# EAGLE schematic voltage_playground (EAGLE 9.4.2)
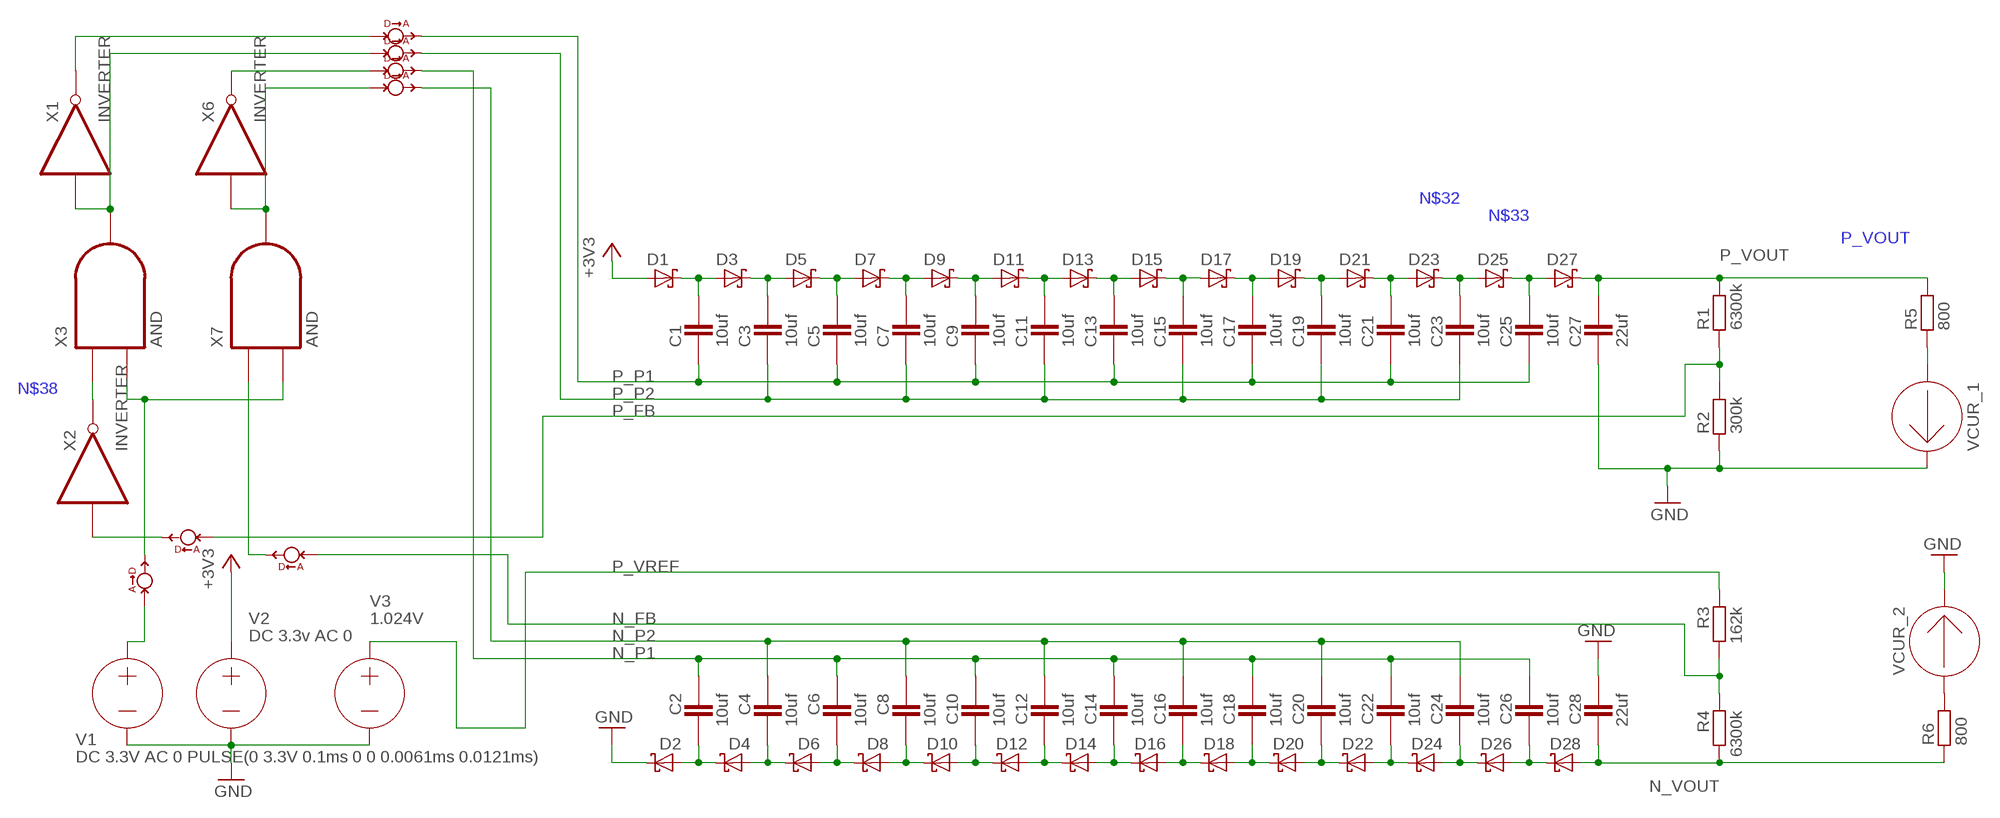
[diagram p0: schematic, sheet 1]

## Parts
C1  10uf  CAPACITOR_1210  [CAPC3225X168N]
C2  10uf  CAPACITOR_1210  [CAPC3225X168N]
C3  10uf  CAPACITOR_1210  [CAPC3225X168N]
C4  10uf  CAPACITOR_1210  [CAPC3225X168N]
C5  10uf  CAPACITOR_1210  [CAPC3225X168N]
C6  10uf  CAPACITOR_1210  [CAPC3225X168N]
C7  10uf  CAPACITOR_1210  [CAPC3225X168N]
C8  10uf  CAPACITOR_1210  [CAPC3225X168N]
C9  10uf  CAPACITOR_1210  [CAPC3225X168N]
C10  10uf  CAPACITOR_1210  [CAPC3225X168N]
C11  10uf  CAPACITOR_1210  [CAPC3225X168N]
C12  10uf  CAPACITOR_1210  [CAPC3225X168N]
C13  10uf  CAPACITOR_1210  [CAPC3225X168N]
C14  10uf  CAPACITOR_1210  [CAPC3225X168N]
C15  10uf  CAPACITOR_1210  [CAPC3225X168N]
C16  10uf  CAPACITOR_1210  [CAPC3225X168N]
C17  10uf  CAPACITOR_1210  [CAPC3225X168N]
C18  10uf  CAPACITOR_1210  [CAPC3225X168N]
C19  10uf  CAPACITOR_1210  [CAPC3225X168N]
C20  10uf  CAPACITOR_1210  [CAPC3225X168N]
C21  10uf  CAPACITOR_1210  [CAPC3225X168N]
C22  10uf  CAPACITOR_1210  [CAPC3225X168N]
C23  10uf  CAPACITOR_1210  [CAPC3225X168N]
C24  10uf  CAPACITOR_1210  [CAPC3225X168N]
C25  10uf  CAPACITOR_1210  [CAPC3225X168N]
C26  10uf  CAPACITOR_1210  [CAPC3225X168N]
C27  22uf  CAPACITOR_1210  [CAPC3225X168N]
C28  22uf  CAPACITOR_1210  [CAPC3225X168N]
D1  SCHOTTKY_SOT-23  [SOT95P280X135-3N]
D2  SCHOTTKY_SOT-23  [SOT95P280X135-3N]
D3  SCHOTTKY_SOT-23  [SOT95P280X135-3N]
D4  SCHOTTKY_SOT-23  [SOT95P280X135-3N]
D5  SCHOTTKY_SOT-23  [SOT95P280X135-3N]
D6  SCHOTTKY_SOT-23  [SOT95P280X135-3N]
D7  SCHOTTKY_SOT-23  [SOT95P280X135-3N]
D8  SCHOTTKY_SOT-23  [SOT95P280X135-3N]
D9  SCHOTTKY_SOT-23  [SOT95P280X135-3N]
D10  SCHOTTKY_SOT-23  [SOT95P280X135-3N]
D11  SCHOTTKY_SOT-23  [SOT95P280X135-3N]
D12  SCHOTTKY_SOT-23  [SOT95P280X135-3N]
D13  SCHOTTKY_SOT-23  [SOT95P280X135-3N]
D14  SCHOTTKY_SOT-23  [SOT95P280X135-3N]
D15  SCHOTTKY_SOT-23  [SOT95P280X135-3N]
D16  SCHOTTKY_SOT-23  [SOT95P280X135-3N]
D17  SCHOTTKY_SOT-23  [SOT95P280X135-3N]
D18  SCHOTTKY_SOT-23  [SOT95P280X135-3N]
D19  SCHOTTKY_SOT-23  [SOT95P280X135-3N]
D20  SCHOTTKY_SOT-23  [SOT95P280X135-3N]
D21  SCHOTTKY_SOT-23  [SOT95P280X135-3N]
D22  SCHOTTKY_SOT-23  [SOT95P280X135-3N]
D23  SCHOTTKY_SOT-23  [SOT95P280X135-3N]
D24  SCHOTTKY_SOT-23  [SOT95P280X135-3N]
D25  SCHOTTKY_SOT-23  [SOT95P280X135-3N]
D26  SCHOTTKY_SOT-23  [SOT95P280X135-3N]
D27  SCHOTTKY_SOT-23  [SOT95P280X135-3N]
D28  SCHOTTKY_SOT-23  [SOT95P280X135-3N]
R1  6300k  RESISTOR_0805  [RESC2012X70N]
R2  300k  RESISTOR_0805  [RESC2012X70N]
R3  162k  RESISTOR_0805  [RESC2012X70N]
R4  6300k  RESISTOR_0805  [RESC2012X70N]
R5  800  RESISTOR_0805  [RESC2012X70N]
R6  800  RESISTOR_0805  [RESC2012X70N]
V1  DC 3.3V AC 0 PULSE(0 3.3V 0.1ms 0 0 0.0061ms 0.0121ms)  VOLTAGE  (no package)
V2  DC 3.3v AC 0  VOLTAGE  (no package)
V3  1.024V  VOLTAGE  (no package)
VCUR_1  AMMETER  (no package)
VCUR_2  AMMETER  (no package)
X1  INVERTER  (no package)
X2  INVERTER  (no package)
X3  AND  (no package)
X4  ATODB  (no package)
X5  ATODB  (no package)
X6  INVERTER  (no package)
X7  AND  (no package)
X8  ATODB  (no package)
X9  DTOAB  (no package)
X10  DTOAB  (no package)
X11  DTOAB  (no package)
X12  DTOAB  (no package)

## Nets
+3V3: D1.1(A) V2.+
GND: C27.1 C28.1 D2.3(C) R2.1 V1.- V2.- V3.- VCUR_1.- VCUR_2.-
N$1: C1.2 D1.3(C) D3.1(A)
N$2: C3.2 D3.3(C) D5.1(A)
N$3: C5.2 D5.3(C) D7.1(A)
N$4: C7.2 D7.3(C) D9.1(A)
N$5: C9.2 D9.3(C) D11.1(A)
N$6: C11.2 D11.3(C) D13.1(A)
N$7: C13.2 D13.3(C) D15.1(A)
N$8: C15.2 D15.3(C) D17.1(A)
N$9: C2.2 D2.1(A) D4.3(C)
N$10: C4.2 D4.1(A) D6.3(C)
N$12: C6.2 D6.1(A) D8.3(C)
N$13: C8.2 D8.1(A) D10.3(C)
N$14: C10.2 D10.1(A) D12.3(C)
N$15: C12.2 D12.1(A) D14.3(C)
N$16: C14.2 D14.1(A) D16.3(C)
N$17: C16.2 D16.1(A) D18.3(C)
N$18: C18.2 D18.1(A) D20.3(C)
N$19: C26.2 D26.1(A) D28.3(C)
N$20: V1.+ X4.AN
N$21: X3.B X4.DIG X7.B
N$22: C17.2 D17.3(C) D19.1(A)
N$23: X1.I X3.Y X10.DIG
N$24: X6.I X7.Y X12.DIG
N$25: X1.O X9.DIG
N$26: X6.O X11.DIG
N$27: X2.I X5.DIG
N$28: X7.A X8.DIG
N$29: R5.1 VCUR_1.+
N$30: C19.2 D19.3(C) D21.1(A)
N$31: C21.2 D21.3(C) D23.1(A)
N$32: C23.2 D23.3(C) D25.1(A)
N$33: C25.2 D25.3(C) D27.1(A)
N$34: C24.2 D24.1(A) D26.3(C)
N$35: C22.2 D22.1(A) D24.3(C)
N$36: C20.2 D20.1(A) D22.3(C)
N$37: R6.2 VCUR_2.+
N$38: X2.O X3.A
N_FB: R3.2 R4.1 X8.AN
N_P1: C2.1 C6.1 C10.1 C14.1 C18.1 C22.1 C26.1 X11.AN
N_P2: C4.1 C8.1 C12.1 C16.1 C20.1 C24.1 X12.AN
N_VOUT: C28.2 D28.1(A) R4.2 R6.1
P_FB: R1.1 R2.2 X5.AN
P_P1: C1.1 C5.1 C9.1 C13.1 C17.1 C21.1 C25.1 X9.AN
P_P2: C3.1 C7.1 C11.1 C15.1 C19.1 C23.1 X10.AN
P_VOUT: C27.2 D27.3(C) R1.2 R5.2
P_VREF: R3.1 V3.+

## Library data of the parts
C1-C28 = ipc-7351-capacitor:CAPACITOR_; SPICEPREFIX: C
D1-D28 = ipc-7351-diode:SCHOTTKY_; SPICEMODEL: DMOD; SPICEPREFIX: D
R1-R6 = ipc-7351-resistor:RESISTOR_; SPICEPREFIX: R
V1-V3 = ngspice-simulation:VOLTAGE: Independent Voltage Source, either DC, AC, PULSE, SINE, PWL, EXP, or SFFM; SPICEPREFIX: V; VALUE: 0V
VCUR_1 VCUR_2 = ngspice-simulation:AMMETER: AMMETER
X1 X2 X6 = ngspice-digital:INVERTER: logic inverter (NOT gate)
X3 X7 = ngspice-digital:AND: 2 input logic AND gate
X4 = ngspice-digital:ATODB: Analog to digital bridge; SPICEMODEL: SINEADC; SPICEPREFIX: X
X5 = ngspice-digital:ATODB: Analog to digital bridge; SPICEMODEL: CMP1024; SPICEPREFIX: X
X8 = ngspice-digital:ATODB: Analog to digital bridge; SPICEMODEL: CMP512; SPICEPREFIX: X
X9-X12 = ngspice-digital:DTOAB: Digital to Analog Bridge; SPICEMODEL: DTOA33; SPICEPREFIX: X